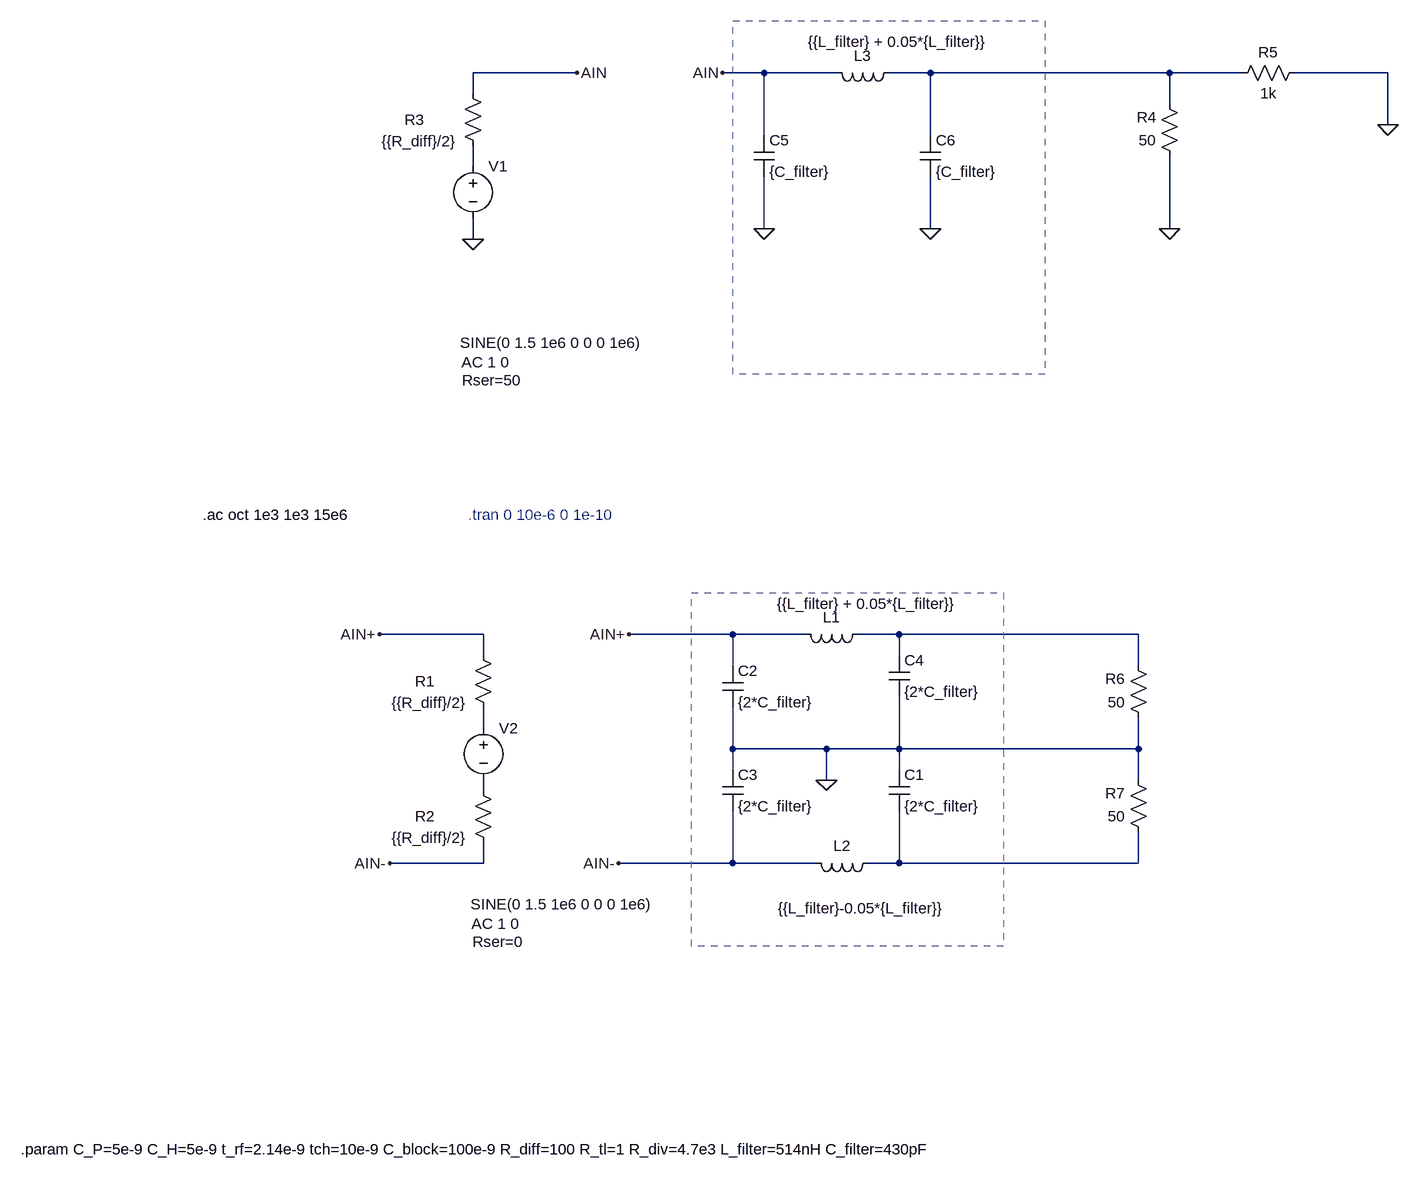
[diagram p0: schematic chebyshev_se_basic.asc]
chebyshev_se_basic.asc, the LTspice schematic file:
Version 4
SHEET 1 1236 2244
WIRE -32 -144 -192 -144
WIRE 256 -144 192 -144
WIRE 368 -144 256 -144
WIRE 512 -144 448 -144
WIRE 880 -144 512 -144
WIRE 992 -144 880 -144
WIRE 1216 -144 1072 -144
WIRE -192 -112 -192 -144
WIRE 880 -96 880 -144
WIRE 1216 -64 1216 -144
WIRE 256 -48 256 -144
WIRE 512 -48 512 -144
WIRE -192 0 -192 -32
WIRE 256 96 256 16
WIRE 512 96 512 16
WIRE 880 96 880 -16
WIRE -192 112 -192 80
WIRE -176 720 -336 720
WIRE 208 720 48 720
WIRE 320 720 208 720
WIRE 464 720 400 720
WIRE 832 720 464 720
WIRE -176 752 -176 720
WIRE 464 752 464 720
WIRE 208 768 208 720
WIRE 832 768 832 720
WIRE -176 864 -176 832
WIRE 208 896 208 832
WIRE 352 896 208 896
WIRE 464 896 464 816
WIRE 464 896 352 896
WIRE 832 896 832 848
WIRE 832 896 464 896
WIRE 208 928 208 896
WIRE 464 928 464 896
WIRE 352 944 352 896
WIRE 832 944 832 896
WIRE -176 960 -176 944
WIRE -176 1072 -176 1040
WIRE -176 1072 -320 1072
WIRE 208 1072 208 992
WIRE 208 1072 32 1072
WIRE 336 1072 208 1072
WIRE 464 1072 464 992
WIRE 464 1072 416 1072
WIRE 832 1072 832 1024
WIRE 832 1072 464 1072
FLAG -336 720 AIN+
FLAG -320 1072 AIN-
FLAG 48 720 AIN+
FLAG 32 1072 AIN-
FLAG -32 -144 AIN
FLAG -192 112 0
FLAG 192 -144 AIN
FLAG 256 96 0
FLAG 512 96 0
FLAG 352 944 0
FLAG 880 96 0
FLAG 1216 -64 0
SYMBOL cap 448 928 R0
SYMATTR InstName C1
SYMATTR Value {2*C_filter}
SYMBOL ind 416 704 R90
WINDOW 0 5 56 VBottom 2
WINDOW 3 -47 1 VTop 2
SYMATTR InstName L1
SYMATTR Value {{L_filter} + 0.05*{L_filter}}
SYMBOL ind 432 1056 R90
WINDOW 0 5 56 VBottom 2
WINDOW 3 70 25 VTop 2
SYMATTR InstName L2
SYMATTR Value {{L_filter}-0.05*{L_filter}}
SYMBOL cap 192 768 R0
SYMATTR InstName C2
SYMATTR Value {2*C_filter}
SYMBOL cap 192 928 R0
SYMATTR InstName C3
SYMATTR Value {2*C_filter}
SYMBOL cap 448 752 R0
SYMATTR InstName C4
SYMATTR Value {2*C_filter}
SYMBOL voltage -176 848 R0
WINDOW 123 -18 317 Left 2
WINDOW 39 -17 345 Left 2
WINDOW 3 -20 287 Left 2
SYMATTR Value2 AC 1 0
SYMATTR SpiceLine Rser=0
SYMATTR Value SINE(0 1.5 1e6 0 0 0 1e6)
SYMATTR InstName V2
SYMBOL voltage -192 -16 R0
WINDOW 123 -18 317 Left 2
WINDOW 39 -17 345 Left 2
WINDOW 3 -20 287 Left 2
SYMATTR Value2 AC 1 0
SYMATTR SpiceLine Rser=50
SYMATTR Value SINE(0 1.5 1e6 0 0 0 1e6)
SYMATTR InstName V1
SYMBOL res -192 736 R0
WINDOW 0 -89 56 Left 2
WINDOW 3 -125 89 Left 2
SYMATTR InstName R1
SYMATTR Value {{R_diff}/2}
SYMBOL res -192 944 R0
WINDOW 0 -89 56 Left 2
WINDOW 3 -125 89 Left 2
SYMATTR InstName R2
SYMATTR Value {{R_diff}/2}
SYMBOL res -208 -128 R0
WINDOW 0 -89 56 Left 2
WINDOW 3 -125 89 Left 2
SYMATTR InstName R3
SYMATTR Value {{R_diff}/2}
SYMBOL ind 464 -160 R90
WINDOW 0 5 56 VBottom 2
WINDOW 3 -47 1 VTop 2
SYMATTR InstName L3
SYMATTR Value {{L_filter} + 0.05*{L_filter}}
SYMBOL cap 240 -48 R0
SYMATTR InstName C5
SYMATTR Value {C_filter}
SYMBOL cap 496 -48 R0
SYMATTR InstName C6
SYMATTR Value {C_filter}
SYMBOL res 896 0 R180
WINDOW 0 36 76 Left 2
WINDOW 3 36 40 Left 2
SYMATTR InstName R4
SYMATTR Value 50
SYMBOL res 976 -128 R270
WINDOW 0 32 56 VTop 2
WINDOW 3 0 56 VBottom 2
SYMATTR InstName R5
SYMATTR Value 1k
SYMBOL res 848 864 R180
WINDOW 0 36 76 Left 2
WINDOW 3 36 40 Left 2
SYMATTR InstName R6
SYMATTR Value 50
SYMBOL res 848 1040 R180
WINDOW 0 36 76 Left 2
WINDOW 3 36 40 Left 2
SYMATTR InstName R7
SYMATTR Value 50
TEXT -200 536 Left 2 ;.tran 0 10e-6 0 1e-10
TEXT -608 536 Left 2 !.ac oct 1e3 1e3 15e6
TEXT -888 1512 Left 2 !.param C_P=5e-9 C_H=5e-9 t_rf=2.14e-9 tch=10e-9 C_block=100e-9 R_diff=100 R_tl=1 R_div=4.7e3 L_filter=514nH C_filter=430pF
RECTANGLE Normal 624 1200 144 656 2
RECTANGLE Normal 688 320 208 -224 2

The netlist it stands for:
* chebyshev_se_basic.asc
C1 0 N006 {2*C_filter}
L1 N003 AIN+ {{L_filter} + 0.05*{L_filter}}
L2 N006 AIN- {{L_filter}-0.05*{L_filter}}
C2 AIN+ 0 {2*C_filter}
C3 0 AIN- {2*C_filter}
C4 N003 0 {2*C_filter}
V2 N004 N005 SINE(0 1.5 1e6 0 0 0 1e6) AC 1 0 Rser=0
V1 N002 0 SINE(0 1.5 1e6 0 0 0 1e6) AC 1 0 Rser=50
R1 AIN+ N004 {{R_diff}/2}
R2 N005 AIN- {{R_diff}/2}
R3 AIN N002 {{R_diff}/2}
L3 N001 AIN {{L_filter} + 0.05*{L_filter}}
C5 AIN 0 {C_filter}
C6 N001 0 {C_filter}
R4 0 N001 50
R5 N001 0 1k
R6 0 N003 50
R7 N006 0 50
* .tran 0 10e-6 0 1e-10
.ac oct 1e3 1e3 15e6
.param C_P=5e-9 C_H=5e-9 t_rf=2.14e-9 tch=10e-9 C_block=100e-9 R_diff=100 R_tl=1 R_div=4.7e3 L_filter=514nH C_filter=430pF
.backanno
.end